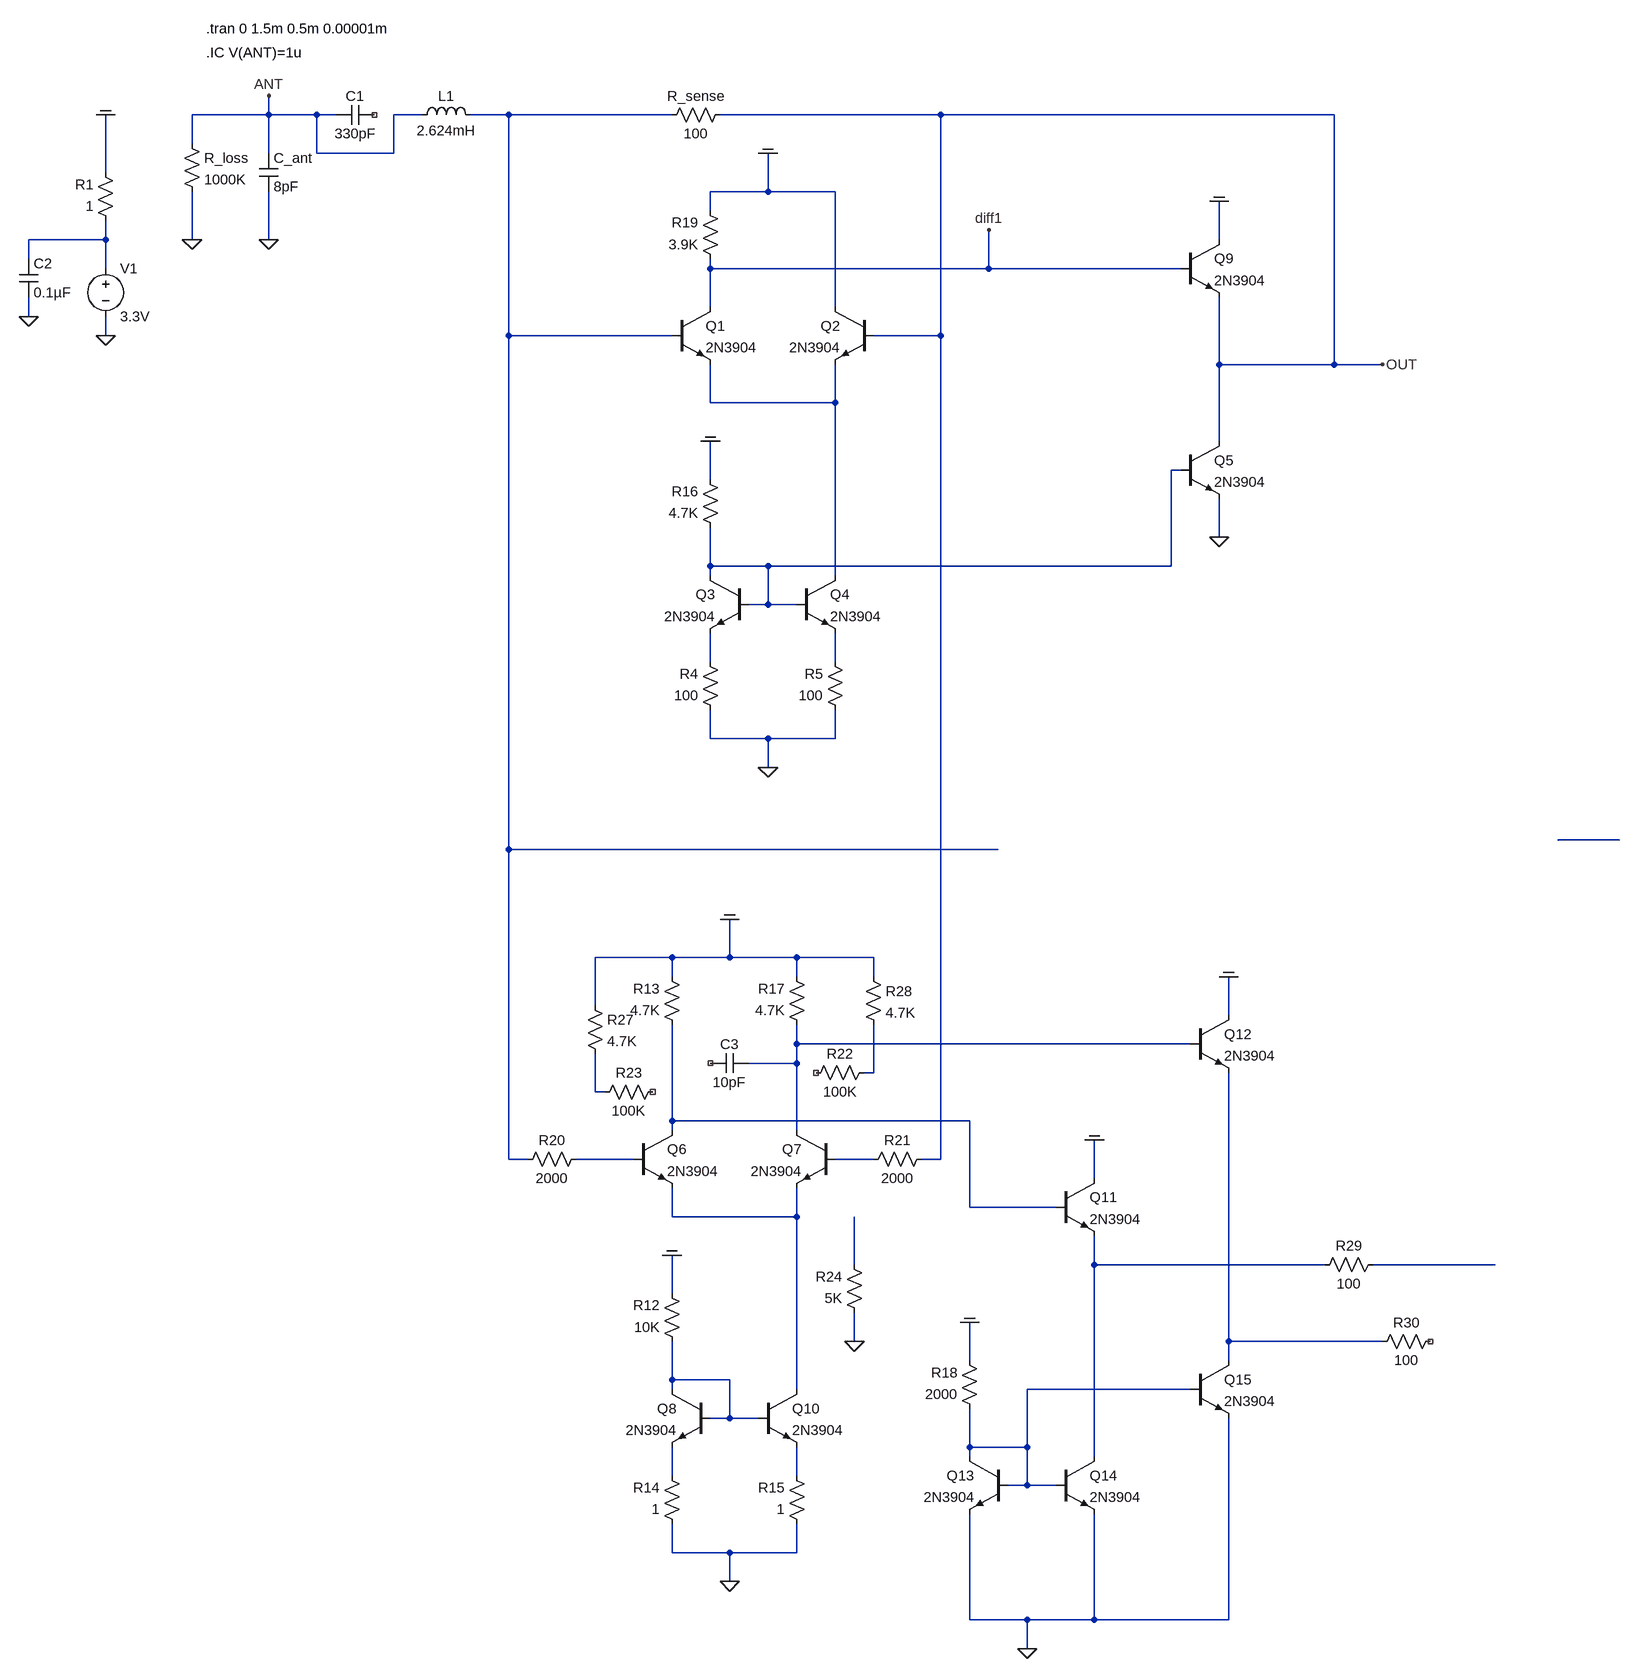
[diagram p0: schematic 2020_current_sense_comparator_npn_v02.asc]
2020_current_sense_comparator_npn_v02.asc, the LTspice schematic file:
Version 4
SHEET 1 3920 3748
WIRE -704 480 -704 448
WIRE -704 480 -832 480
WIRE -624 480 -704 480
WIRE -592 480 -624 480
WIRE -448 480 -496 480
WIRE -304 480 -368 480
WIRE -32 480 -304 480
WIRE 416 480 48 480
WIRE 1072 480 416 480
WIRE -832 528 -832 480
WIRE -704 544 -704 480
WIRE -624 544 -624 480
WIRE -496 544 -496 480
WIRE -496 544 -624 544
WIRE -976 576 -976 480
WIRE 128 608 128 544
WIRE 128 608 32 608
WIRE 240 608 128 608
WIRE 32 640 32 608
WIRE -976 688 -976 656
WIRE -976 688 -1104 688
WIRE -832 688 -832 608
WIRE -704 688 -704 608
WIRE 880 688 880 624
WIRE -1104 720 -1104 688
WIRE -976 736 -976 688
WIRE 32 736 32 720
WIRE 496 736 496 672
WIRE 496 736 32 736
WIRE 816 736 496 736
WIRE 32 800 32 736
WIRE 240 800 240 608
WIRE -1104 816 -1104 784
WIRE -976 848 -976 816
WIRE -304 848 -304 480
WIRE -32 848 -304 848
WIRE 416 848 416 480
WIRE 416 848 304 848
WIRE 880 896 880 784
WIRE 1072 896 1072 480
WIRE 1072 896 880 896
WIRE 1152 896 1072 896
WIRE 32 960 32 896
WIRE 240 960 240 896
WIRE 240 960 32 960
WIRE 880 1024 880 896
WIRE 816 1072 800 1072
WIRE 32 1088 32 1024
WIRE 880 1184 880 1120
WIRE 32 1232 32 1168
WIRE 128 1232 32 1232
WIRE 800 1232 800 1072
WIRE 800 1232 128 1232
WIRE 32 1248 32 1232
WIRE 240 1248 240 960
WIRE 128 1296 128 1232
WIRE 128 1296 96 1296
WIRE 176 1296 128 1296
WIRE 32 1392 32 1344
WIRE 240 1392 240 1344
WIRE 32 1520 32 1472
WIRE 128 1520 32 1520
WIRE 240 1520 240 1472
WIRE 240 1520 128 1520
WIRE 128 1568 128 1520
WIRE 2656 1952 1856 1952
WIRE -304 1968 -304 848
WIRE 512 1968 -304 1968
WIRE -32 2240 -160 2240
WIRE 64 2240 64 2176
WIRE 64 2240 -32 2240
WIRE 176 2240 64 2240
WIRE 304 2240 176 2240
WIRE -32 2272 -32 2240
WIRE 176 2272 176 2240
WIRE 304 2272 304 2240
WIRE -160 2320 -160 2240
WIRE 896 2336 896 2272
WIRE 176 2384 176 2352
WIRE 832 2384 176 2384
WIRE 176 2416 176 2384
WIRE 176 2416 96 2416
WIRE 304 2432 304 2352
WIRE 304 2432 288 2432
WIRE -160 2464 -160 2400
WIRE -144 2464 -160 2464
WIRE -32 2512 -32 2352
WIRE 464 2512 -32 2512
WIRE -32 2528 -32 2512
WIRE 176 2528 176 2416
WIRE -304 2576 -304 1968
WIRE -272 2576 -304 2576
WIRE -96 2576 -192 2576
WIRE 304 2576 240 2576
WIRE 416 2576 416 848
WIRE 416 2576 384 2576
WIRE 672 2608 672 2544
WIRE 464 2656 464 2512
WIRE 608 2656 464 2656
WIRE -32 2672 -32 2624
WIRE 176 2672 176 2624
WIRE 176 2672 -32 2672
WIRE 272 2752 272 2672
WIRE 672 2752 672 2704
WIRE 1056 2752 672 2752
WIRE 1360 2752 1136 2752
WIRE -32 2800 -32 2736
WIRE 272 2880 272 2832
WIRE 896 2880 896 2432
WIRE 1152 2880 896 2880
WIRE 464 2912 464 2848
WIRE 896 2912 896 2880
WIRE -32 2944 -32 2880
WIRE 64 2944 -32 2944
WIRE -32 2960 -32 2944
WIRE 176 2960 176 2672
WIRE 832 2960 560 2960
WIRE 64 3008 64 2944
WIRE 64 3008 32 3008
WIRE 112 3008 64 3008
WIRE 464 3056 464 2992
WIRE 560 3056 560 2960
WIRE 560 3056 464 3056
WIRE 464 3072 464 3056
WIRE 672 3072 672 2752
WIRE -32 3104 -32 3056
WIRE 176 3104 176 3056
WIRE 560 3120 560 3056
WIRE 560 3120 528 3120
WIRE 608 3120 560 3120
WIRE -32 3232 -32 3184
WIRE 64 3232 -32 3232
WIRE 176 3232 176 3184
WIRE 176 3232 64 3232
WIRE 64 3280 64 3232
WIRE 464 3344 464 3168
WIRE 560 3344 464 3344
WIRE 672 3344 672 3168
WIRE 672 3344 560 3344
WIRE 896 3344 896 3008
WIRE 896 3344 672 3344
WIRE 560 3392 560 3344
FLAG -976 848 0
FLAG -976 480 COM
FLAG -704 688 0
FLAG -704 448 ANT
FLAG -832 688 0
FLAG 128 1568 0
FLAG 128 544 COM
FLAG 32 1024 COM
FLAG 880 624 COM
FLAG 1152 896 OUT
FLAG 496 672 diff1
FLAG -1104 816 0
FLAG 880 1184 0
FLAG 64 3280 0
FLAG 64 2176 COM
FLAG -32 2736 COM
FLAG 896 2272 COM
FLAG 672 2544 COM
FLAG 560 3392 0
FLAG 464 2848 COM
FLAG 272 2880 0
SYMBOL voltage -976 720 R0
WINDOW 123 0 0 Left 0
WINDOW 39 0 0 Left 0
SYMATTR InstName V1
SYMATTR Value 3.3V
SYMBOL ind -464 496 R270
WINDOW 0 32 56 VTop 2
WINDOW 3 5 56 VBottom 2
SYMATTR InstName L1
SYMATTR Value 2.624mH
SYMATTR SpiceLine Rser=66 Rpar=10Meg Cpar=1.216pF
SYMBOL cap -720 544 R0
SYMATTR InstName C_ant
SYMATTR Value 8pF
SYMBOL res -848 512 R0
SYMATTR InstName R_loss
SYMATTR Value 1000K
SYMBOL res 64 464 R90
WINDOW 0 0 56 VBottom 2
WINDOW 3 32 56 VTop 2
SYMATTR InstName R_sense
SYMATTR Value 100
SYMBOL npn -32 800 R0
SYMATTR InstName Q1
SYMATTR Value 2N3904
SYMBOL npn 304 800 M0
SYMATTR InstName Q2
SYMATTR Value 2N3904
SYMBOL npn 96 1248 M0
SYMATTR InstName Q3
SYMATTR Value 2N3904
SYMBOL npn 176 1248 R0
SYMATTR InstName Q4
SYMATTR Value 2N3904
SYMBOL res 48 1184 R180
WINDOW 0 36 76 Left 2
WINDOW 3 36 40 Left 2
SYMATTR InstName R16
SYMATTR Value 4.7K
SYMBOL res 48 736 R180
WINDOW 0 36 76 Left 2
WINDOW 3 36 40 Left 2
SYMATTR InstName R19
SYMATTR Value 3.9K
SYMBOL npn 816 688 R0
SYMATTR InstName Q9
SYMATTR Value 2N3904
SYMBOL res -960 672 R180
WINDOW 0 36 76 Left 2
WINDOW 3 36 40 Left 2
SYMATTR InstName R1
SYMATTR Value 1
SYMBOL cap -1120 720 R0
SYMATTR InstName C2
SYMATTR Value 0.1µF
SYMBOL npn 816 1024 R0
SYMATTR InstName Q5
SYMATTR Value 2N3904
SYMBOL res 48 1488 R180
WINDOW 0 36 76 Left 2
WINDOW 3 36 40 Left 2
SYMATTR InstName R4
SYMATTR Value 100
SYMBOL res 256 1488 R180
WINDOW 0 36 76 Left 2
WINDOW 3 36 40 Left 2
SYMATTR InstName R5
SYMATTR Value 100
SYMBOL cap -528 464 R90
WINDOW 0 0 32 VBottom 2
WINDOW 3 32 32 VTop 2
SYMATTR InstName C1
SYMATTR Value 330pF
SYMBOL npn -96 2528 R0
SYMATTR InstName Q6
SYMATTR Value 2N3904
SYMBOL npn 240 2528 M0
SYMATTR InstName Q7
SYMATTR Value 2N3904
SYMBOL npn 32 2960 M0
SYMATTR InstName Q8
SYMATTR Value 2N3904
SYMBOL npn 112 2960 R0
SYMATTR InstName Q10
SYMATTR Value 2N3904
SYMBOL res -16 2896 R180
WINDOW 0 36 76 Left 2
WINDOW 3 36 40 Left 2
SYMATTR InstName R12
SYMATTR Value 10K
SYMBOL res -16 2368 R180
WINDOW 0 36 76 Left 2
WINDOW 3 36 40 Left 2
SYMATTR InstName R13
SYMATTR Value 4.7K
SYMBOL res -16 3200 R180
WINDOW 0 36 76 Left 2
WINDOW 3 36 40 Left 2
SYMATTR InstName R14
SYMATTR Value 1
SYMBOL res 192 3200 R180
WINDOW 0 36 76 Left 2
WINDOW 3 36 40 Left 2
SYMATTR InstName R15
SYMATTR Value 1
SYMBOL res 192 2368 R180
WINDOW 0 36 76 Left 2
WINDOW 3 36 40 Left 2
SYMATTR InstName R17
SYMATTR Value 4.7K
SYMBOL npn 608 2608 R0
SYMATTR InstName Q11
SYMATTR Value 2N3904
SYMBOL npn 832 2336 R0
SYMATTR InstName Q12
SYMATTR Value 2N3904
SYMBOL npn 528 3072 M0
SYMATTR InstName Q13
SYMATTR Value 2N3904
SYMBOL npn 608 3072 R0
SYMATTR InstName Q14
SYMATTR Value 2N3904
SYMBOL res 480 3008 R180
WINDOW 0 36 76 Left 2
WINDOW 3 36 40 Left 2
SYMATTR InstName R18
SYMATTR Value 2000
SYMBOL npn 832 2912 R0
SYMATTR InstName Q15
SYMATTR Value 2N3904
SYMBOL res -288 2592 R270
WINDOW 0 32 56 VTop 2
WINDOW 3 0 56 VBottom 2
SYMATTR InstName R20
SYMATTR Value 2000
SYMBOL res 288 2592 R270
WINDOW 0 32 56 VTop 2
WINDOW 3 0 56 VBottom 2
SYMATTR InstName R21
SYMATTR Value 2000
SYMBOL res 192 2448 R270
WINDOW 0 32 56 VTop 2
WINDOW 3 0 56 VBottom 2
SYMATTR InstName R22
SYMATTR Value 100K
SYMBOL res -160 2480 R270
WINDOW 0 32 56 VTop 2
WINDOW 3 0 56 VBottom 2
SYMATTR InstName R23
SYMATTR Value 100K
SYMBOL res 288 2848 R180
WINDOW 0 36 76 Left 2
WINDOW 3 36 40 Left 2
SYMATTR InstName R24
SYMATTR Value 5K
SYMBOL cap 96 2400 R90
WINDOW 0 0 32 VBottom 2
WINDOW 3 32 32 VTop 2
SYMATTR InstName C3
SYMATTR Value 10pF
SYMBOL res -176 2304 R0
SYMATTR InstName R27
SYMATTR Value 4.7K
SYMBOL res 288 2256 R0
SYMATTR InstName R28
SYMATTR Value 4.7K
SYMBOL res 1040 2768 R270
WINDOW 0 32 56 VTop 2
WINDOW 3 0 56 VBottom 2
SYMATTR InstName R29
SYMATTR Value 100
SYMBOL res 1136 2896 R270
WINDOW 0 32 56 VTop 2
WINDOW 3 0 56 VBottom 2
SYMATTR InstName R30
SYMATTR Value 100
TEXT -808 336 Left 2 !.tran 0 1.5m 0.5m 0.00001m
TEXT -808 376 Left 2 !.IC V(ANT)=1u

The netlist it stands for:
* 2020_current_sense_comparator_npn_v02.asc
V1 N002 0 3.3V
L1 ANT N001 2.624mH Rser=66 Rpar=10Meg Cpar=1.216pF
C_ant ANT 0 8pF
R_loss ANT 0 1000K
R_sense OUT N001 100
Q1 diff1 N001 N003 0 2N3904
Q2 COM OUT N003 0 2N3904
Q3 N004 N004 N005 0 2N3904
Q4 N003 N004 N006 0 2N3904
R16 N004 COM 4.7K
R19 diff1 COM 3.9K
Q9 COM diff1 OUT 0 2N3904
R1 N002 COM 1
C2 N002 0 0.1µF
Q5 OUT N004 0 0 2N3904
R4 0 N005 100
R5 0 N006 100
C1 NC_01 ANT 330pF
Q6 N011 N012 N014 0 2N3904
Q7 N008 N013 N014 0 2N3904
Q8 N019 N019 N021 0 2N3904
Q10 N014 N019 N022 0 2N3904
R12 N019 COM 10K
R13 N011 COM 4.7K
R14 0 N021 1
R15 0 N022 1
R17 N008 COM 4.7K
Q11 COM N011 N016 0 2N3904
Q12 COM N008 N018 0 2N3904
Q13 N020 N020 0 0 2N3904
Q14 N016 N020 0 0 2N3904
R18 N020 COM 2000
Q15 N018 N020 0 0 2N3904
R20 N001 N012 2000
R21 N013 OUT 2000
R22 NC_02 N009 100K
R23 N010 NC_03 100K
R24 0 N015 5K
C3 N008 NC_04 10pF
R27 COM N010 4.7K
R28 COM N009 4.7K
R29 N016 N017 100
R30 N018 NC_05 100
.model NPN NPN
.model PNP PNP
.lib standard.bjt
.tran 0 1.5m 0.5m 0.00001m
.IC V(ANT)=1u
.backanno
.end